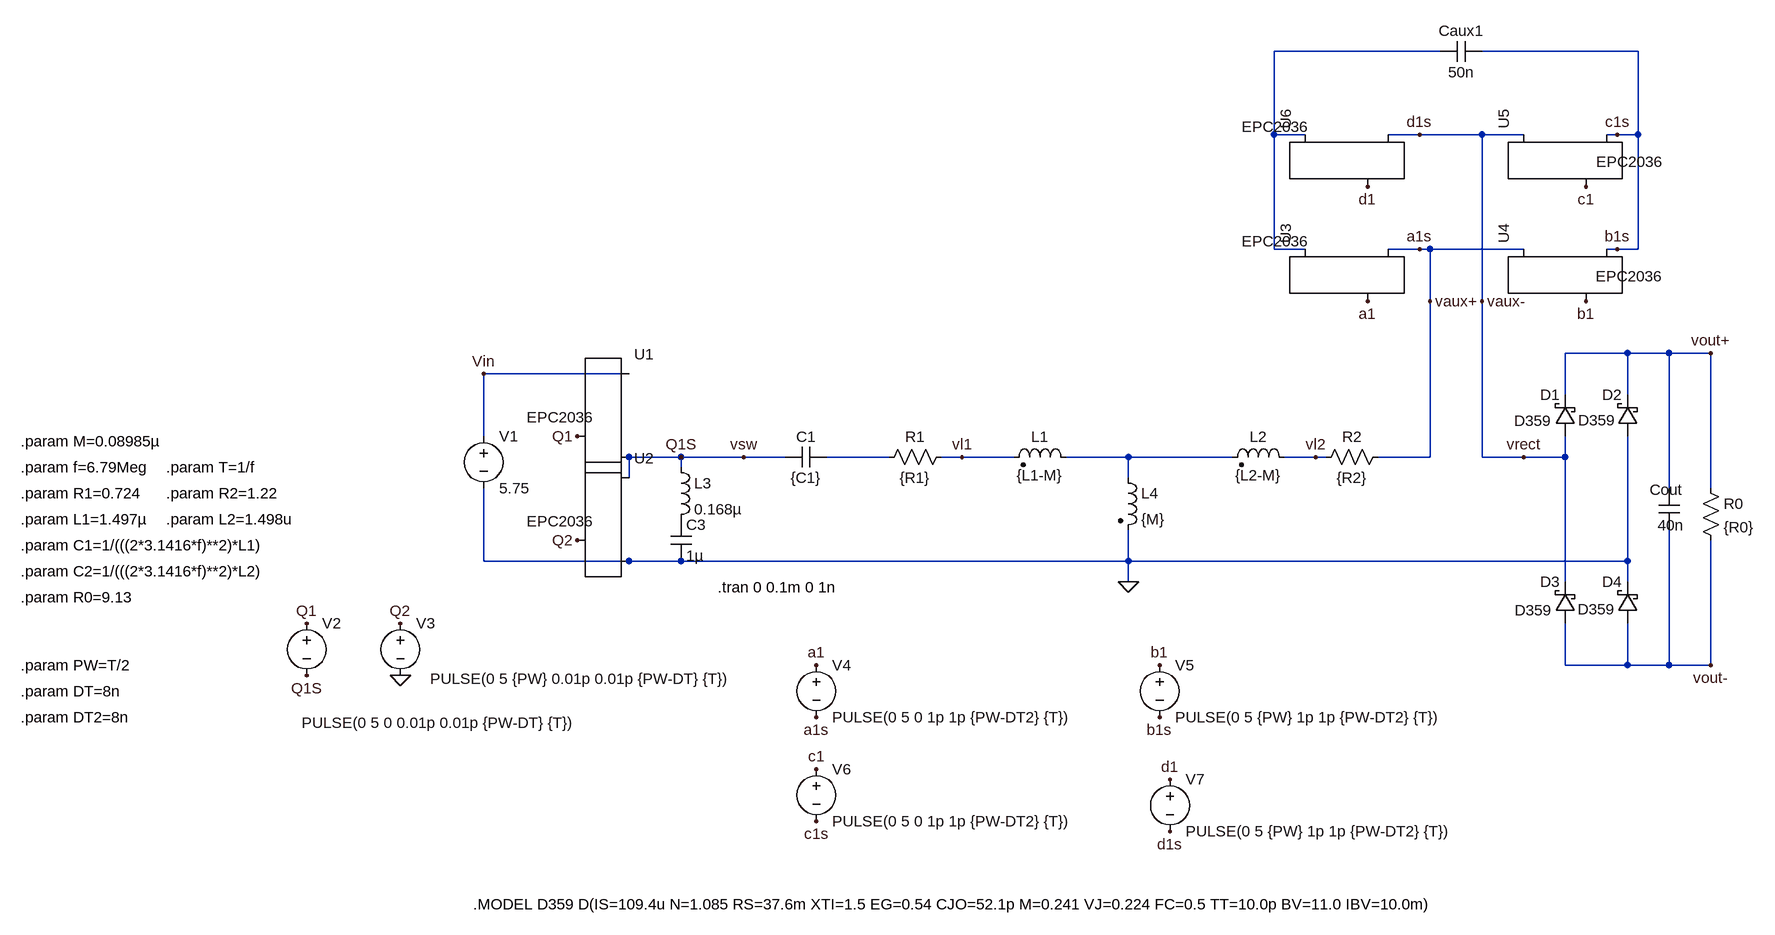
[diagram p0: schematic DBS_Tmodel_prototype.asc]
DBS_Tmodel_prototype.asc, the LTspice schematic file:
Version 4
SHEET 1 2368 1432
WIRE -32 -128 -288 -128
WIRE 272 -128 32 -128
WIRE -288 0 -288 -128
WIRE -240 0 -288 0
WIRE -64 0 -112 0
WIRE 32 0 -64 0
WIRE 96 0 32 0
WIRE 240 0 224 0
WIRE 272 0 272 -128
WIRE 272 0 240 0
WIRE -288 176 -288 0
WIRE -240 176 -288 176
WIRE -64 176 -112 176
WIRE -48 176 -64 176
WIRE 96 176 -48 176
WIRE 240 176 224 176
WIRE 272 176 272 0
WIRE 272 176 240 176
WIRE -48 256 -48 176
WIRE 32 256 32 0
WIRE 256 336 160 336
WIRE 320 336 256 336
WIRE 384 336 320 336
WIRE -1280 368 -1504 368
WIRE 160 400 160 336
WIRE 256 400 256 336
WIRE -1504 464 -1504 368
WIRE -1200 496 -1280 496
WIRE -1104 496 -1200 496
WIRE -1040 496 -1104 496
WIRE -880 496 -976 496
WIRE -768 496 -800 496
WIRE -688 496 -768 496
WIRE -512 496 -608 496
WIRE -352 496 -512 496
WIRE -224 496 -272 496
WIRE -208 496 -224 496
WIRE -48 496 -48 256
WIRE -48 496 -128 496
WIRE 32 496 32 256
WIRE 96 496 32 496
WIRE 160 496 160 464
WIRE 160 496 96 496
WIRE -1200 512 -1200 496
WIRE -1280 528 -1280 496
WIRE -512 528 -512 496
WIRE 320 544 320 336
WIRE 384 544 384 336
WIRE -1504 656 -1504 544
WIRE -1280 656 -1504 656
WIRE -1200 656 -1280 656
WIRE -512 656 -512 608
WIRE -512 656 -1200 656
WIRE 256 656 256 464
WIRE 256 656 -512 656
WIRE -512 688 -512 656
WIRE 160 688 160 496
WIRE 256 688 256 656
WIRE 160 816 160 752
WIRE 256 816 256 752
WIRE 256 816 160 816
WIRE 320 816 320 608
WIRE 320 816 256 816
WIRE 384 816 384 624
WIRE 384 816 320 816
FLAG -512 688 0
FLAG -768 496 vl1
FLAG -224 496 vl2
FLAG -1360 464 Q1
FLAG -1360 624 Q2
FLAG -1632 832 0
FLAG -1200 496 Q1S
FLAG -1776 832 Q1S
FLAG -1504 368 Vin
FLAG -1776 752 Q1
FLAG -1632 752 Q2
FLAG -1104 496 vsw
FLAG 384 336 vout+
FLAG 384 816 vout-
FLAG 96 496 vrect
FLAG -144 256 a1
FLAG 192 80 c1
FLAG 192 256 b1
FLAG -144 80 d1
FLAG 32 256 vaux-
FLAG -64 176 a1s
FLAG -64 0 d1s
FLAG 240 176 b1s
FLAG 240 0 c1s
FLAG -48 256 vaux+
FLAG -992 816 a1
FLAG -464 816 b1
FLAG -992 896 a1s
FLAG -464 896 b1s
FLAG -992 976 c1
FLAG -448 992 d1
FLAG -992 1056 c1s
FLAG -448 1072 d1s
SYMBOL cap -976 480 R90
WINDOW 0 0 32 VBottom 2
WINDOW 3 32 32 VTop 2
SYMATTR InstName C1
SYMATTR Value {C1}
SYMBOL ind2 -592 512 M270
WINDOW 0 32 56 VTop 2
WINDOW 3 4 56 VBottom 2
SYMATTR InstName L1
SYMATTR Value {L1-M}
SYMATTR Type ind
SYMBOL ind2 -256 512 M270
WINDOW 0 32 56 VTop 2
WINDOW 3 4 56 VBottom 2
SYMATTR InstName L2
SYMATTR Value {L2-M}
SYMATTR Type ind
SYMBOL res -784 480 R90
WINDOW 0 0 56 VBottom 2
WINDOW 3 32 56 VTop 2
SYMATTR InstName R1
SYMATTR Value {R1}
SYMBOL res -112 480 R90
WINDOW 0 0 56 VBottom 2
WINDOW 3 32 56 VTop 2
SYMATTR InstName R2
SYMATTR Value {R2}
SYMBOL voltage -1776 736 R0
WINDOW 123 0 0 Left 0
WINDOW 39 0 0 Left 0
WINDOW 3 -8 169 Left 2
SYMATTR Value PULSE(0 5 0 0.01p 0.01p {PW-DT} {T})
SYMATTR InstName V2
SYMBOL EPCGaN -1360 464 R0
WINDOW 3 -78 -29 Left 2
SYMATTR Value EPC2036
SYMATTR InstName U1
SYMBOL EPCGaN -1360 624 R0
WINDOW 3 -78 -29 Left 2
SYMATTR Value EPC2036
SYMATTR InstName U2
SYMBOL voltage -1504 448 R0
WINDOW 123 0 0 Left 0
WINDOW 39 0 0 Left 0
SYMATTR InstName V1
SYMATTR Value 5.75
SYMBOL voltage -1632 736 R0
WINDOW 123 0 0 Left 0
WINDOW 39 0 0 Left 0
WINDOW 3 46 101 Left 2
SYMATTR Value PULSE(0 5 {PW} 0.01p 0.01p {PW-DT} {T})
SYMATTR InstName V3
SYMBOL cap -1216 592 R0
SYMATTR InstName C3
SYMATTR Value 1µ
SYMBOL ind -1216 496 R0
SYMATTR InstName L3
SYMATTR Value 0.168µ
SYMBOL res 368 528 R0
SYMATTR InstName R0
SYMATTR Value {R0}
SYMBOL cap 304 544 R0
WINDOW 0 -14 2 Left 2
WINDOW 3 -2 57 Left 2
SYMATTR InstName Cout
SYMATTR Value 40n
SYMBOL schottky 176 464 R180
WINDOW 0 24 64 Left 2
WINDOW 3 37 24 Left 2
SYMATTR InstName D1
SYMATTR Value D359
SYMBOL schottky 272 464 R180
WINDOW 0 24 64 Left 2
WINDOW 3 34 25 Left 2
SYMATTR InstName D2
SYMATTR Value D359
SYMBOL schottky 176 752 R180
WINDOW 0 24 64 Left 2
WINDOW 3 36 20 Left 2
SYMATTR InstName D3
SYMATTR Value D359
SYMBOL schottky 272 752 R180
WINDOW 0 24 64 Left 2
WINDOW 3 35 22 Left 2
SYMATTR InstName D4
SYMATTR Value D359
SYMBOL cap 32 -144 R90
WINDOW 0 0 32 VBottom 2
WINDOW 3 32 32 VTop 2
SYMATTR InstName Caux1
SYMATTR Value 50n
SYMBOL EPCGaN -144 256 R270
WINDOW 3 92 -194 VRight 2
SYMATTR Value EPC2036
SYMATTR InstName U3
SYMBOL EPCGaN 192 256 R270
WINDOW 3 38 15 VRight 2
SYMATTR Value EPC2036
SYMATTR InstName U4
SYMBOL EPCGaN 192 80 R270
WINDOW 3 38 16 VRight 2
SYMATTR Value EPC2036
SYMATTR InstName U5
SYMBOL EPCGaN -144 80 R270
WINDOW 3 92 -194 VRight 2
SYMATTR Value EPC2036
SYMATTR InstName U6
SYMBOL voltage -992 800 R0
WINDOW 123 0 0 Left 0
WINDOW 39 24 124 Left 2
SYMATTR InstName V4
SYMATTR Value PULSE(0 5 0 1p 1p {PW-DT2} {T})
SYMBOL voltage -464 800 R0
WINDOW 123 0 0 Left 0
WINDOW 39 24 124 Left 2
SYMATTR InstName V5
SYMATTR Value PULSE(0 5 {PW} 1p 1p {PW-DT2} {T})
SYMBOL voltage -992 960 R0
WINDOW 123 0 0 Left 0
WINDOW 39 24 124 Left 2
SYMATTR InstName V6
SYMATTR Value PULSE(0 5 0 1p 1p {PW-DT2} {T})
SYMBOL voltage -448 976 R0
WINDOW 123 0 0 Left 0
WINDOW 39 24 124 Left 2
SYMATTR InstName V7
SYMATTR Value PULSE(0 5 {PW} 1p 1p {PW-DT2} {T})
SYMBOL ind2 -528 512 R0
SYMATTR InstName L4
SYMATTR Value {M}
SYMATTR Type ind
TEXT -1144 696 Left 2 !.tran 0 0.1m 0 1n
TEXT -2216 816 Left 2 !.param PW=T/2
TEXT -2216 856 Left 2 !.param DT=8n
TEXT -2216 592 Left 2 !.param L1=1.497µ
TEXT -2216 552 Left 2 !.param R1=0.724
TEXT -2216 632 Left 2 !.param C1=1/(((2*3.1416*f)**2)*L1)
TEXT -2216 512 Left 2 !.param f=6.79Meg
TEXT -1992 512 Left 2 !.param T=1/f
TEXT -1992 552 Left 2 !.param R2=1.22
TEXT -1992 592 Left 2 !.param L2=1.498u
TEXT -2216 672 Left 2 !.param C2=1/(((2*3.1416*f)**2)*L2)
TEXT -2216 712 Left 2 !.param R0=9.13
TEXT -1520 1184 Left 2 !.MODEL D359 D(IS=109.4u N=1.085 RS=37.6m XTI=1.5 EG=0.54 CJO=52.1p M=0.241 VJ=0.224 FC=0.5 TT=10.0p BV=11.0 IBV=10.0m)
TEXT -2216 896 Left 2 !.param DT2=8n
TEXT -2216 472 Left 2 !.param M=0.08985µ

The netlist it stands for:
* DBS_Tmodel_prototype.asc
C1 N002 vsw {C1}
L1 N003 vl1 {L1-M}
L2 vl2 N003 {L2-M}
R1 vl1 N002 {R1}
R2 vaux+ vl2 {R2}
V2 Q1 vsw PULSE(0 5 0 0.01p 0.01p {PW-DT} {T})
XU1 Q1 Vin vsw EPC2036
XU2 Q2 vsw 0 EPC2036
V1 Vin 0 5.75
V3 Q2 0 PULSE(0 5 {PW} 0.01p 0.01p {PW-DT} {T})
C3 P001 0 1µ
L3 vsw P001 0.168µ
R0 vout+ vout- {R0}
Cout vout+ vout- 40n
D1 d1s vout+ D359
D2 0 vout+ D359
D3 vout- d1s D359
D4 vout- 0 D359
Caux1 c1s N001 50n
XU3 a1 N001 vaux+ EPC2036
XU4 b1 vaux+ c1s EPC2036
XU5 c1 d1s c1s EPC2036
XU6 d1 N001 d1s EPC2036
V4 a1 vaux+ PULSE(0 5 0 1p 1p {PW-DT2} {T})
V5 b1 c1s PULSE(0 5 {PW} 1p 1p {PW-DT2} {T})
V6 c1 c1s PULSE(0 5 0 1p 1p {PW-DT2} {T})
V7 d1 d1s PULSE(0 5 {PW} 1p 1p {PW-DT2} {T})
L4 N003 0 {M}
.model D D
.lib standard.dio
.tran 0 0.1m 0 1n
.param PW=T/2
.param DT=8n
.param L1=1.497µ
.param R1=0.724
.param C1=1/(((2*3.1416*f)**2)*L1)
.param f=6.79Meg
.param T=1/f
.param R2=1.22
.param L2=1.498u
.param C2=1/(((2*3.1416*f)**2)*L2)
.param R0=9.13
.MODEL D359 D(IS=109.4u N=1.085 RS=37.6m XTI=1.5 EG=0.54 CJO=52.1p M=0.241 VJ=0.224 FC=0.5 TT=10.0p BV=11.0 IBV=10.0m)
.param DT2=8n
.param M=0.08985µ
.backanno
.end